# EAGLE design taxi (EAGLE 8.0.1)
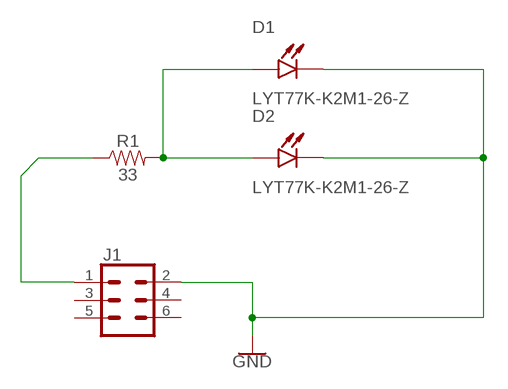
[diagram p0: schematic, sheet 1]

## Parts
D1  LYT77K-K2M1-26-Z  [LED_LYT77K-K2M1-26-Z]
D2  LYT77K-K2M1-26-Z  [LED_LYT77K-K2M1-26-Z]
J1  CONN_03X2SHROUD  [2X3-SHROUDED]
R1  33  33OHM-0603-1/10W-1%  [0603]

## Nets
GND: D1.1(C) D2.1(C) J1.2
N$1: J1.1 R1.1
N$3: D1.2(A) D2.2(A) R1.2
Unconnected: J1.3 J1.4 J1.5 J1.6

## Library data of the parts
D1 D2 = BoZe Reverse LED topled osram:LYT77K-K2M1-26-Z: Topled Yellow Rev.Gul; AVAILABILITY: Unavailable; DESCRIPTION: Topled Yellow Rev.Gul; MF: Osram; MP: LYT77K-K2M1-26-Z; PACKAGE: None; PRICE: None
J1 = SparkFun-Connectors:CONN_03X2: Multi connection point. Often used as Generic Header-pin footprint for 0.1 inch spaced/style header connections You can populate with any combo of single row headers, but if you'd like an exact match, check these: Header - 2x3 (Male, 0.1") <https://www.sparkfun.com/products/12807> (PRT-12807) Header - 2x3 (Female, 0.1") <https://www.sparkfun.com/products/13010> (PRT-13010) 2x3 Pin Shrouded Header <https://www.sparkfun.com/products/10877> (PRT-10877) On any of the 0.1 inch spaced packages, you can populate with these: Break Away Headers - Straight <https://www.sparkfun.com/products/116> (PRT-00116) Break Away Male Headers - Right Angle <https://www.sparkfun.com/products/553> (PRT-00553) Female Headers <https://www.sparkfun.com/products/115> (PRT-00115) Break Away Headers - Machine Pin <https://www.sparkfun.com/products/117> (PRT-00117) Break Away Female Headers - Swiss Machine Pin <https://www.sparkfun.com/products/743> (PRT-00743) Special note: the shrouded connector mates well with our 3x2 ribbon cables: Ribbon Crimp Connector - 6-pin (2x3, Female) <https://www.sparkfun.com/products/10651> (PRT-10651) Ribbon Cable - 6 wire (15ft) <https://www.sparkfun.com/products/10646> (PRT-10646); PROD_ID: CONN-10681; SF_ID: PRT_10877
R1 = SparkFun-Resistors:33OHM: 33Ω resistor A resistor is a passive two-terminal electrical component that implements electrical resistance as a circuit element. Resistors act to reduce current flow, and, at the same time, act to lower voltage levels within circuits. - Wikipedia; PROD_ID: RES-08270

## Net classes
0 default: clearance 0.025 mm

## Board
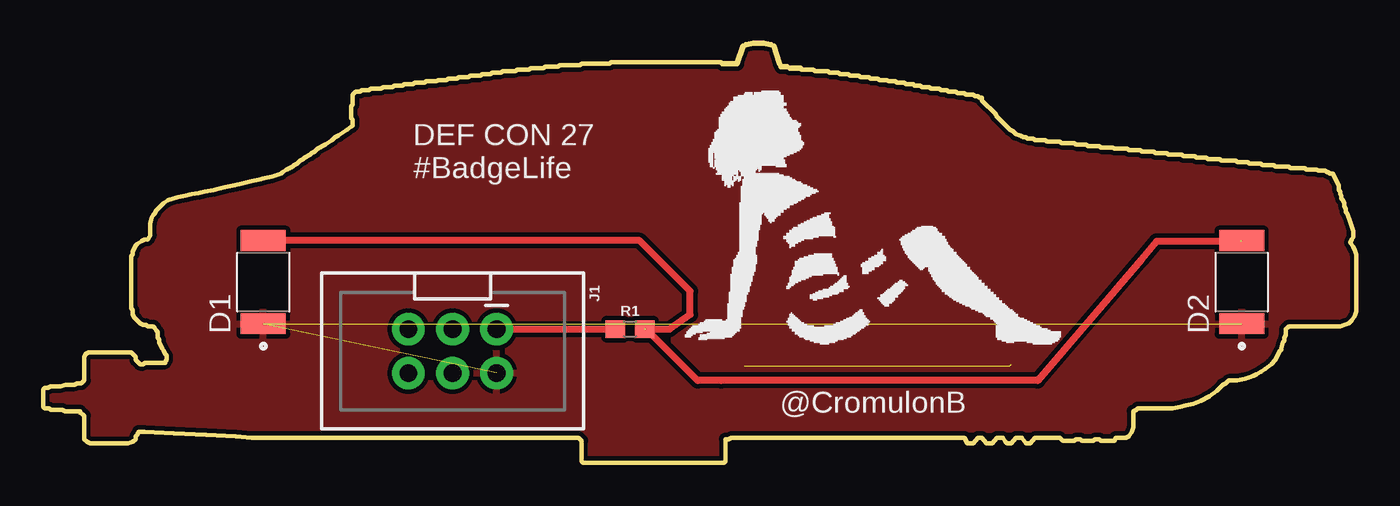
[diagram p1: board, top side]
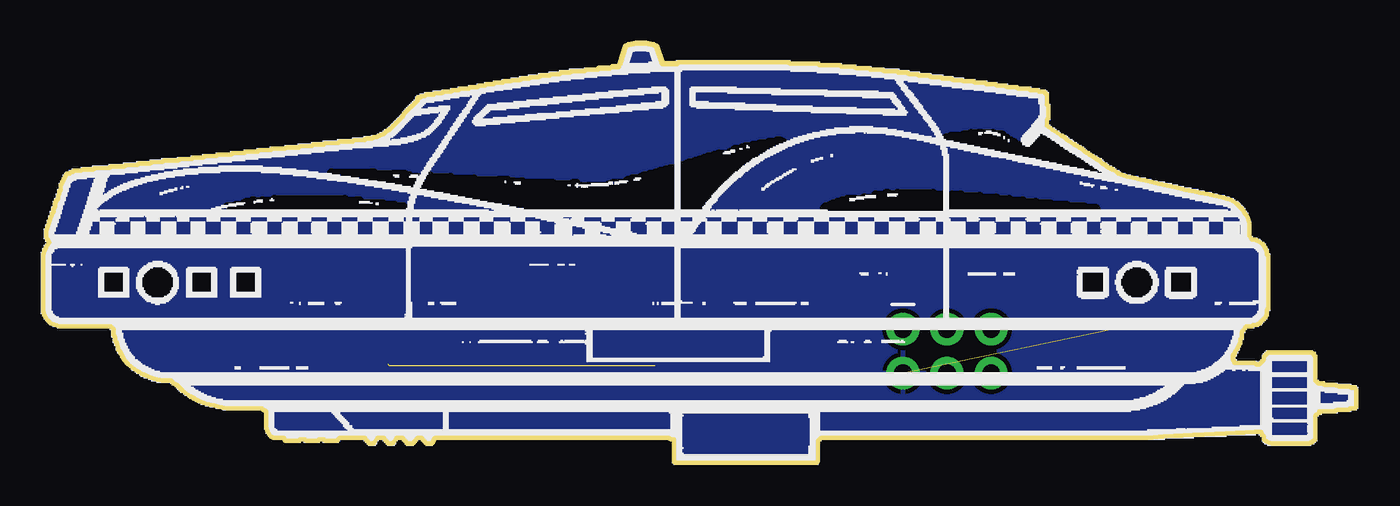
[diagram p2: board, bottom side, seen from below]

Size 75.77 x 24.21 mm. Coordinates in mm from the lower left corner, seen from the top.
Outline: 23.96,22.27 23.87,22.18 23.37,22.18 23.28,22.1 22.77,22.1 22.69,22.01 22.1,22.01 22.01,21.93 21.42,21.93 21.33,21.84 20.83,21.84 20.74,21.76 20.23,21.76 20.15,21.67 19.64,21.67 19.47,21.59 18.88,21.59 18.79,21.5 18.37,21.5 18.29,21.42 18.03,21.42 17.86,21.25 17.86,20.66 17.78,20.57 17.78,19.89 17.86,19.81 17.86,19.47 17.78,19.39 17.52,19.22 17.02,18.88 16.85,18.79 16.68,18.62 16.25,18.37 15.83,18.12 15.66,17.95 15.49,17.86 15.41,17.78 15.07,17.61 14.98,17.52 14.82,17.44 14.65,17.27 14.48,17.19 14.39,17.1 14.22,17.02 14.05,16.93 13.8,16.76 13.71,16.68 13.21,16.51 12.78,16.42 12.44,16.34 12.02,16.25 11.68,16.17 11.34,16.09 10.92,16 10.5,15.92 10.16,15.83 9.82,15.75 9.31,15.66 8.97,15.58 8.55,15.49 8.21,15.41 7.79,15.32 7.2,15.15 6.94,14.98 6.52,14.56 6.43,14.39 6.35,14.31 6.26,14.14 6.18,13.8 6.18,13.12 6.1,12.95 6.01,12.87 5.84,12.87 5.67,12.78 5.42,12.61 5.33,12.53 5.25,12.36 5.16,12.19 5.16,12.02 5.08,11.94 5.08,8.89 5.16,8.8 5.16,8.55 5.25,8.38 5.33,8.3 5.59,8.04 5.76,7.96 5.93,7.96 6.01,7.87 6.35,7.87 6.43,7.79 6.52,7.62 6.6,7.53 6.6,7.2 6.69,7.11 6.69,6.94 6.77,6.77 6.86,6.6 6.94,6.43 7.03,6.26 7.11,6.18 7.11,5.93 7.03,5.84 7.03,5.76 5.84,5.76 5.76,5.67 5.59,5.67 5.33,5.93 5.33,6.1 5.16,6.26 5.08,6.35 2.62,6.35 2.46,6.26 2.37,6.1 2.37,4.74 2.29,4.66 2.2,4.57 1.95,4.57 1.78,4.49 1.27,4.49 1.02,4.4 0.42,4.4 0.25,4.32 0.08,4.32 0,4.23 0,3.22 0.08,3.13 0.34,3.13 0.42,3.05 1.1,3.05 1.27,2.96 2.12,2.96 2.12,2.88 2.29,2.79 2.37,2.71 2.37,1.35 2.54,1.19 2.71,1.1 4.91,1.1 5.16,1.19 5.33,1.35 5.33,1.52 5.42,1.61 5.5,1.78 5.84,1.78 7.53,1.69 9.4,1.61 11.09,1.52 12.02,1.44 30.9,1.44 31.07,1.27 31.07,0.08 31.15,0 39.28,0 39.37,0.08 39.37,1.35 39.54,1.35 39.7,1.44 53.17,1.44 53.33,1.1 53.67,1.1 53.93,1.44 54.18,1.44 54.44,1.1 54.77,1.1 55.03,1.44 55.37,1.44 55.54,1.19 55.62,1.1 55.87,1.1 56.13,1.44 56.47,1.44 56.72,1.1 56.98,1.1 57.23,1.44 58.67,1.44 58.84,1.27 59.51,1.27 59.6,1.35 59.85,1.35 59.94,1.27 60.62,1.27 60.7,1.35 60.95,1.35 61.04,1.27 61.8,1.27 61.89,1.44 62.48,1.44 62.65,1.52 62.82,1.78 62.9,2.03 62.9,2.96 63.07,3.05 63.16,3.13 65.19,3.13 65.61,3.22 65.95,3.3 66.37,3.39 66.8,3.56 67.3,3.81 67.73,4.15 68.07,4.49 68.23,4.57 68.4,4.74 68.91,4.74 69.34,4.83 69.59,4.91 69.84,4.99 70.01,5.08 70.27,5.25 70.52,5.42 70.86,5.67 71.11,5.93 71.2,6.1 71.37,6.43 71.45,6.52
Outline: 23.96,22.27 23.96,22.27
Outline: 23.96,22.27 24.55,22.27 24.64,22.35 25.23,22.35 25.31,22.43 25.82,22.43 25.91,22.52 26.41,22.52 26.5,22.6 27.26,22.6 27.34,22.69 28.02,22.69 28.11,22.77 28.87,22.77 28.95,22.86 29.72,22.86 29.8,22.94 30.99,22.94 31.07,23.03 32.68,23.03 32.76,23.11 39.11,23.11 39.2,23.03 40.04,23.03 40.38,24.04 40.55,24.13 40.97,24.21 41.57,24.21 41.99,24.13 42.16,24.04 42.5,23.03 42.58,22.86 42.92,22.86 43.09,22.77 43.68,22.77 43.77,22.69 44.45,22.69 44.53,22.6 45.29,22.6 45.38,22.52 45.88,22.52 45.97,22.43 46.48,22.43 46.56,22.35 47.07,22.35 47.15,22.27 47.66,22.27 47.75,22.18 48.17,22.18 48.26,22.1 48.68,22.1 48.76,22.01 49.19,22.01 49.27,21.93 49.69,21.93 49.78,21.84 50.2,21.84 50.29,21.76 50.63,21.76 50.71,21.67 51.13,21.67 51.22,21.59 51.73,21.59 51.81,21.5 52.15,21.5 52.23,21.42 52.66,21.42 52.74,21.33 53.17,21.33 53.25,21.25 53.67,21.25 53.76,21.16 53.93,21.16 54.01,21.08 54.18,21.08 54.18,20.91 54.94,20.15 55.03,19.98 55.79,19.22 55.96,19.13 56.13,18.96 56.38,18.88 56.55,18.79 56.72,18.79 56.81,18.71 57.14,18.71 57.23,18.62 57.82,18.62 57.91,18.54 58.67,18.54 58.75,18.46 59.51,18.46 59.6,18.37 60.19,18.37 60.28,18.29 60.95,18.29 61.04,18.2 61.72,18.2 61.8,18.12 62.56,18.12 62.65,18.03 63.32,18.03 63.41,17.95 64.09,17.95 64.17,17.86 64.85,17.86 64.93,17.78 65.69,17.78 65.78,17.69 66.46,17.69 66.54,17.61 67.13,17.61 67.22,17.52 67.9,17.52 67.98,17.44 68.83,17.44 68.91,17.36 69.5,17.36 69.59,17.27 70.27,17.27 70.35,17.19 71.03,17.19 71.11,17.1 71.87,17.1 71.96,17.02 72.81,17.02 72.89,16.93 73.48,16.93 73.57,16.85 73.99,16.85 74.08,16.76 74.16,16.76 74.25,16.68 74.41,16.68 74.5,16.51 74.58,16.34 74.75,16 74.75,15.75 74.84,15.66 74.84,15.49 74.92,15.41 74.92,15.24 75.01,15.15 75.09,14.98 75.09,14.82 75.18,14.65 75.18,14.48 75.26,14.39 75.43,13.88 75.52,13.63 75.6,13.38 75.6,13.04 75.52,12.87 75.43,12.7 75.6,12.44 75.68,12.28 75.77,12.02 75.77,8.72 75.68,8.47 75.52,8.21 75.35,8.04 75.09,7.96 74.84,7.87 71.87,7.87 71.79,7.79 71.71,7.7 71.71,7.37 71.62,7.2 71.62,7.03 71.54,6.94 71.45,6.6
Copper layers (1*16): Top 0.035mm / dielectric 1.5mm / Bottom 0.035mm
Design rules "default *": minimum track width 10mil, minimum drill 24mil, track to track 8mil, track to pad 8mil, pad to pad 8mil, via to via 8mil, smd to smd 8mil, copper to edge 5mil, drill to drill 8mil, minimum pad ring 10mil, minimum via ring 8mil, stop-mask expansion 4mil, vias tented up to drill 0mil, thermal gap 10mil
bRestrict: area 12.3,9.5 to 13,9.6; area 68.8,9.5 to 69.6,9.6; area 12.1,9.6 to 13.2,9.7; area 68.6,9.6 to 69.7,9.7; area 12.1,9.7 to 13.3,9.8; area 68.5,9.7 to 69.8,9.8; area 12,9.8 to 13.3,9.9; area 68.5,9.8 to 69.9,9.9; area 9.5,9.9 to 10.7,9.9; area 11.9,9.9 to 13.4,9.9; area 14.6,9.9 to 15.8,9.9; area 63.5,9.9 to 64.6,9.9; area 66.1,9.9 to 67.2,9.9; area 68.5,9.9 to 69.9,9.9; area 71.2,9.9 to 72.3,9.9; area 9.5,9.9 to 10.7,10; area 11.8,9.9 to 13.4,10; area 14.6,9.9 to 15.8,10; area 63.5,9.9 to 64.6,10; area 66.1,9.9 to 67.2,10; area 68.4,9.9 to 70,10; area 71.2,9.9 to 72.3,10; area 9.5,10 to 10.7,10.1; area 11.8,10 to 13.5,10.1; area 14.6,10 to 15.8,10.1; area 63.5,10 to 64.6,10.1; area 66.1,10 to 67.2,10.1; area 68.4,10 to 70,10.1; area 71.2,10 to 72.3,10.1; area 9.5,10.1 to 10.7,10.2; area 11.8,10.1 to 13.5,10.2; area 14.6,10.1 to 15.8,10.2; area 63.5,10.1 to 64.6,10.2; area 66.1,10.1 to 67.2,10.2; area 68.3,10.1 to 70.1,10.2; area 71.2,10.1 to 72.3,10.2; area 9.5,10.2 to 10.7,10.3; area 11.7,10.2 to 13.6,10.3; area 14.6,10.2 to 15.8,10.3; area 63.5,10.2 to 64.6,10.3; area 66.1,10.2 to 67.2,10.3; area 68.3,10.2 to 70.1,10.3; area 71.2,10.2 to 72.3,10.3; area 9.5,10.3 to 10.7,10.4; area 11.7,10.3 to 13.6,10.4; area 14.6,10.3 to 15.8,10.4; area 63.5,10.3 to 64.6,10.4; area 66.1,10.3 to 67.2,10.4; area 68.3,10.3 to 70.1,10.4; area 71.2,10.3 to 72.3,10.4; area 9.5,10.4 to 10.7,10.5; area 11.7,10.4 to 13.6,10.5; area 14.6,10.4 to 15.8,10.5; area 63.5,10.4 to 64.6,10.5; area 66.1,10.4 to 67.2,10.5; area 68.3,10.4 to 70.1,10.5; area 71.2,10.4 to 72.3,10.5; area 9.5,10.5 to 10.7,10.5; area 11.7,10.5 to 13.6,10.5; area 14.6,10.5 to 15.8,10.5; area 63.5,10.5 to 64.6,10.5; area 66.1,10.5 to 67.2,10.5; area 68.3,10.5 to 70.1,10.5; area 71.2,10.5 to 72.3,10.5; area 9.5,10.5 to 10.7,10.6; area 11.7,10.5 to 13.6,10.6; area 14.6,10.5 to 15.8,10.6; area 63.5,10.5 to 64.6,10.6; area 66.1,10.5 to 67.2,10.6; area 68.3,10.5 to 70.1,10.6; area 71.2,10.5 to 72.3,10.6; area 9.5,10.6 to 10.7,10.7; area 11.8,10.6 to 13.5,10.7; area 14.6,10.6 to 15.8,10.7; area 63.5,10.6 to 64.6,10.7; area 66.1,10.6 to 67.2,10.7; area 68.3,10.6 to 70.1,10.7; area 71.2,10.6 to 72.3,10.7; area 9.5,10.7 to 10.7,10.8; area 11.8,10.7 to 13.5,10.8; area 14.6,10.7 to 15.8,10.8; area 63.5,10.7 to 64.6,10.8; area 66.1,10.7 to 67.2,10.8; area 68.4,10.7 to 70,10.8; area 71.2,10.7 to 72.3,10.8; area 9.5,10.8 to 10.7,10.9; area 11.9,10.8 to 13.4,10.9; area 14.6,10.8 to 15.8,10.9; area 63.5,10.8 to 64.6,10.9; area 66.1,10.8 to 67.2,10.9; area 68.4,10.8 to 70,10.9; area 71.2,10.8 to 72.3,10.9; area 9.5,10.9 to 10.7,11; area 11.9,10.9 to 13.4,11; area 14.6,10.9 to 15.8,11; area 63.5,10.9 to 64.6,11; area 66.1,10.9 to 67.2,11; area 68.5,10.9 to 69.9,11; area 71.2,10.9 to 72.3,11; area 12,11 to 13.3,11; area 68.5,11 to 69.8,11; area 12.1,11 to 13.3,11.1; area 68.6,11 to 69.7,11.1; area 12.1,11.1 to 13.1,11.2; area 68.7,11.1 to 69.6,11.2; area 12.4,11.2 to 12.9,11.3; area 68.9,11.2 to 69.5,11.3; area 23.8,14.5 to 30.5,14.6; area 15,14.6 to 23.5,14.7; area 23.8,14.6 to 30.7,14.7; area 37.7,14.6 to 39,14.7; area 39.3,14.6 to 48,14.7; area 54.8,14.6 to 64.9,14.7; area 15.7,14.7 to 23.5,14.8; area 23.8,14.7 to 30.6,14.8; area 37.7,14.7 to 39,14.8; area 39.3,14.7 to 48.5,14.8; area 55,14.7 to 65.2,14.8; area 16.7,14.8 to 23.5,14.9; area 23.8,14.8 to 30.4,14.9; area 37.6,14.8 to 39,14.9; area 39.3,14.8 to 48.9,14.9; area 55.5,14.8 to 64.2,14.9; area 64.3,14.8 to 64.6,14.9; area 17.7,14.9 to 23.5,14.9; area 23.8,14.9 to 30.2,14.9; area 37.5,14.9 to 39,14.9; area 39.3,14.9 to 49.3,14.9; area 56.2,14.9 to 56.4,14.9; area 56.6,14.9 to 64.2,14.9; area 18.5,14.9 to 23.5,15; area 23.8,14.9 to 29.9,15; area 37.5,14.9 to 39,15; area 39.3,14.9 to 49.7,15; area 57.5,14.9 to 63.5,15; area 63.6,14.9 to 64.1,15; area 19.3,15 to 23.5,15.1; area 23.8,15 to 29.7,15.1; area 37.5,15 to 39,15.1; area 39.3,15 to 50.2,15.1; area 57.5,15 to 57.6,15.1; area 57.7,15 to 63.1,15.1; area 63.6,15 to 63.7,15.1; area 20,15.1 to 23.5,15.2; area 23.8,15.1 to 28.9,15.2; area 29.3,15.1 to 29.3,15.2; area 37.4,15.1 to 39,15.2; area 39.3,15.1 to 50.6,15.2; area 58.4,15.1 to 62.4,15.2; area 20.8,15.2 to 23.5,15.3; area 23.8,15.2 to 28.4,15.3; area 37.3,15.2 to 39,15.3; area 39.3,15.2 to 51,15.3; area 21.7,15.3 to 23.5,15.4; area 23.8,15.3 to 27.7,15.4; area 37.2,15.3 to 39,15.4; area 39.3,15.3 to 51.4,15.4; area 22.8,15.4 to 23.3,15.5; area 23.8,15.4 to 26.5,15.5; area 27.1,15.4 to 27.7,15.5; area 37.2,15.4 to 39,15.5; area 39.3,15.4 to 51.9,15.5; area 24.4,15.5 to 26.5,15.5; area 27.1,15.5 to 27.1,15.5; area 37.1,15.5 to 39,15.5; area 39.3,15.5 to 52.3,15.5; area 37,15.5 to 39,15.6; area 39.3,15.5 to 52.7,15.6; area 37,15.6 to 39,15.7; area 39.3,15.6 to 53.2,15.7; area 36.9,15.7 to 39,15.8; area 39.3,15.7 to 53.6,15.8; area 36.8,15.8 to 39,15.9; area 39.3,15.8 to 54.1,15.9; area 36.7,15.9 to 39,16; area 39.3,15.9 to 44.3,16; area 44.7,15.9 to 44.9,16; area 45,15.9 to 54,16; area 54.4,15.9 to 54.6,16; area 36.6,16 to 39,16; area 39.3,16 to 43.1,16; area 45.1,16 to 45.3,16; area 45.5,16 to 54,16; area 54.4,16 to 55.1,16; area 36.5,16 to 39,16.1; area 39.3,16 to 42.5,16.1; area 42.8,16 to 42.9,16.1; area 45,16 to 45.2,16.1; area 46.4,16 to 48.2,16.1; area 48.6,16 to 53.9,16.1; area 54.3,16 to 55.5,16.1; area 36.4,16.1 to 39,16.2; area 39.3,16.1 to 42.1,16.2; area 48.1,16.1 to 48.2,16.2; area 48.6,16.1 to 49.1,16.2; area 49.1,16.1 to 53.9,16.2; area 54.3,16.1 to 56,16.2; area 36.4,16.2 to 39,16.3; area 39.3,16.2 to 42,16.3; area 49,16.2 to 49.1,16.3; area 49.1,16.2 to 49.2,16.3; area 49.5,16.2 to 53.8,16.3; area 54.2,16.2 to 56.5,16.3; area 36.3,16.3 to 39,16.4; area 39.3,16.3 to 41.4,16.4; area 41.7,16.3 to 41.8,16.4; area 50.9,16.3 to 53.8,16.4; area 54.2,16.3 to 57,16.4; area 36.2,16.4 to 39,16.5; area 39.3,16.4 to 41.3,16.5; area 52.3,16.4 to 53.7,16.5; area 54.2,16.4 to 57.5,16.5; area 36.1,16.5 to 39,16.6; area 39.3,16.5 to 41.1,16.6; area 53.5,16.5 to 53.6,16.6; area 53.6,16.5 to 53.7,16.6; area 54.7,16.5 to 55.2,16.6; area 55.5,16.5 to 58,16.6; area 36,16.6 to 39,16.6; area 39.3,16.6 to 40.8,16.6; area 54.9,16.6 to 55,16.6; area 55.2,16.6 to 55.2,16.6; area 55.6,16.6 to 58.6,16.6; area 35.9,16.6 to 39,16.7; area 39.3,16.6 to 40.4,16.7; area 56.7,16.6 to 56.8,16.7; area 56.9,16.6 to 59.1,16.7; area 14.7,16.7 to 14.9,16.8; area 35.9,16.7 to 39,16.8; area 39.3,16.7 to 40.2,16.8; area 14.9,16.8 to 15.4,16.9; area 35.7,16.8 to 39,16.9; area 39.3,16.8 to 39.8,16.9; area 14.9,16.9 to 15.7,17; area 35.6,16.9 to 39,17; area 39.3,16.9 to 39.6,17; area 15.1,17 to 16.1,17.1; area 35.5,17 to 39,17.1; area 15.2,17.1 to 16.6,17.1; area 35.4,17.1 to 38.9,17.1; area 15.4,17.1 to 17,17.2; area 35.3,17.1 to 38.7,17.2; area 15.5,17.2 to 17.3,17.3; area 35.2,17.2 to 38.5,17.3; area 15.6,17.3 to 17.7,17.4; area 35,17.3 to 38.1,17.4; area 15.7,17.4 to 18.2,17.5; area 34.9,17.4 to 37.9,17.5; area 15.9,17.5 to 18.5,17.6; area 34.8,17.5 to 37.6,17.6; area 16,17.6 to 18.9,17.7; area 34.7,17.6 to 37.4,17.7; area 16.1,17.7 to 19.3,17.7; area 34.5,17.7 to 37,17.7; area 16.2,17.7 to 19.7,17.8; area 34.4,17.7 to 36.8,17.8; area 16.4,17.8 to 20.1,17.9; area 34.2,17.8 to 36.1,17.9; area 16.6,17.9 to 20.5,18; area 34.1,17.9 to 35.9,18; area 16.6,18 to 20.9,18.1; area 34,18 to 35.9,18.1; area 16.8,18.1 to 21.3,18.2; area 33.8,18.1 to 35.4,18.2; area 16.9,18.2 to 19.1,18.2; area 19.2,18.2 to 21.7,18.2; area 33.7,18.2 to 35,18.2; area 35.2,18.2 to 35.3,18.2; area 17.1,18.2 to 18.8,18.3; area 19.3,18.2 to 22.1,18.3; area 33.5,18.2 to 34.8,18.3; area 17.1,18.3 to 18.8,18.4; area 19.7,18.3 to 22.1,18.4; area 22.2,18.3 to 22.5,18.4; area 33.3,18.3 to 34.4,18.4; area 17.3,18.4 to 18.7,18.5; area 19.8,18.4 to 22.9,18.5; area 33.1,18.4 to 33.9,18.5; area 17.4,18.5 to 18.6,18.6; area 19.9,18.5 to 20,18.6; area 20.1,18.5 to 23.2,18.6; area 33.2,18.5 to 33.4,18.6; area 17.6,18.6 to 18.5,18.7; area 20.1,18.6 to 23.7,18.7; area 17.7,18.7 to 18.4,18.8; area 20.2,18.7 to 20.3,18.8; area 20.4,18.7 to 23.7,18.8; area 17.8,18.8 to 18.3,18.8; area 20.4,18.8 to 23.4,18.8; area 17.9,18.8 to 18.2,18.9; area 20.4,18.8 to 20.5,18.9; area 20.7,18.8 to 22.6,18.9; area 18.1,18.9 to 18.2,19; area 21,18.9 to 21.6,19; area 21.8,18.9 to 22.2,19

### Footprints (pad centres in the part's own frame; a part is rotated, then mirrored left to right if it is on the bottom)
LED_LYT77K-K2M1-26-Z = smd 1.2 x 2.6: 1 -2.4,0; 2 2.4,0
2X3-SHROUDED = drill 1.016 pad 1.88: 1 -1.27,2.54; 2 1.27,2.54; 3 -1.27,0; 4 1.27,0; 5 -1.27,-2.54; 6 1.27,-2.54
0603 = smd 1.1 x 1: 1 -0.85,0; 2 0.85,0

### Placement (x,y rotation side)
D1  12.7,10.42 90 top
D2  69.17,10.42 90 top
J1  23.62,6.43 270 top
R1  33.86,7.7 0 top

### Tracks (layer width: path | path; a pad name or v marks a point on that pad's centre or on a via)
GND  (2 unrouted)
  pour Top (isolate 0.254): -2.46,-4.32 -2.46,28.61 80.09,28.61 80.09,-4.4
  pour Bottom (isolate 0.254): -2.46,-4.91 -2.46,28.61 80.51,28.61 80.51,-4.91
N$1
  Top 0.406: J1.1 30.3,7.71 R1.1
N$3  (2 unrouted)
  Top 0.406: R1.2 36.15,7.7 37.33,8.55 37.33,9.91 34.42,12.82 D1.2 | 69.08,12.78 64.26,12.78 63.41,11.77 57.4,4.74 39.11,4.74 37.76,4.74 34.79,7.7
N$5  (2 unrouted)

### Text on the board
tNames: DEF CON 27 / #BadgeLife | @CromulonB